# EAGLE design SmartCoffee (EAGLE 7.6.0)
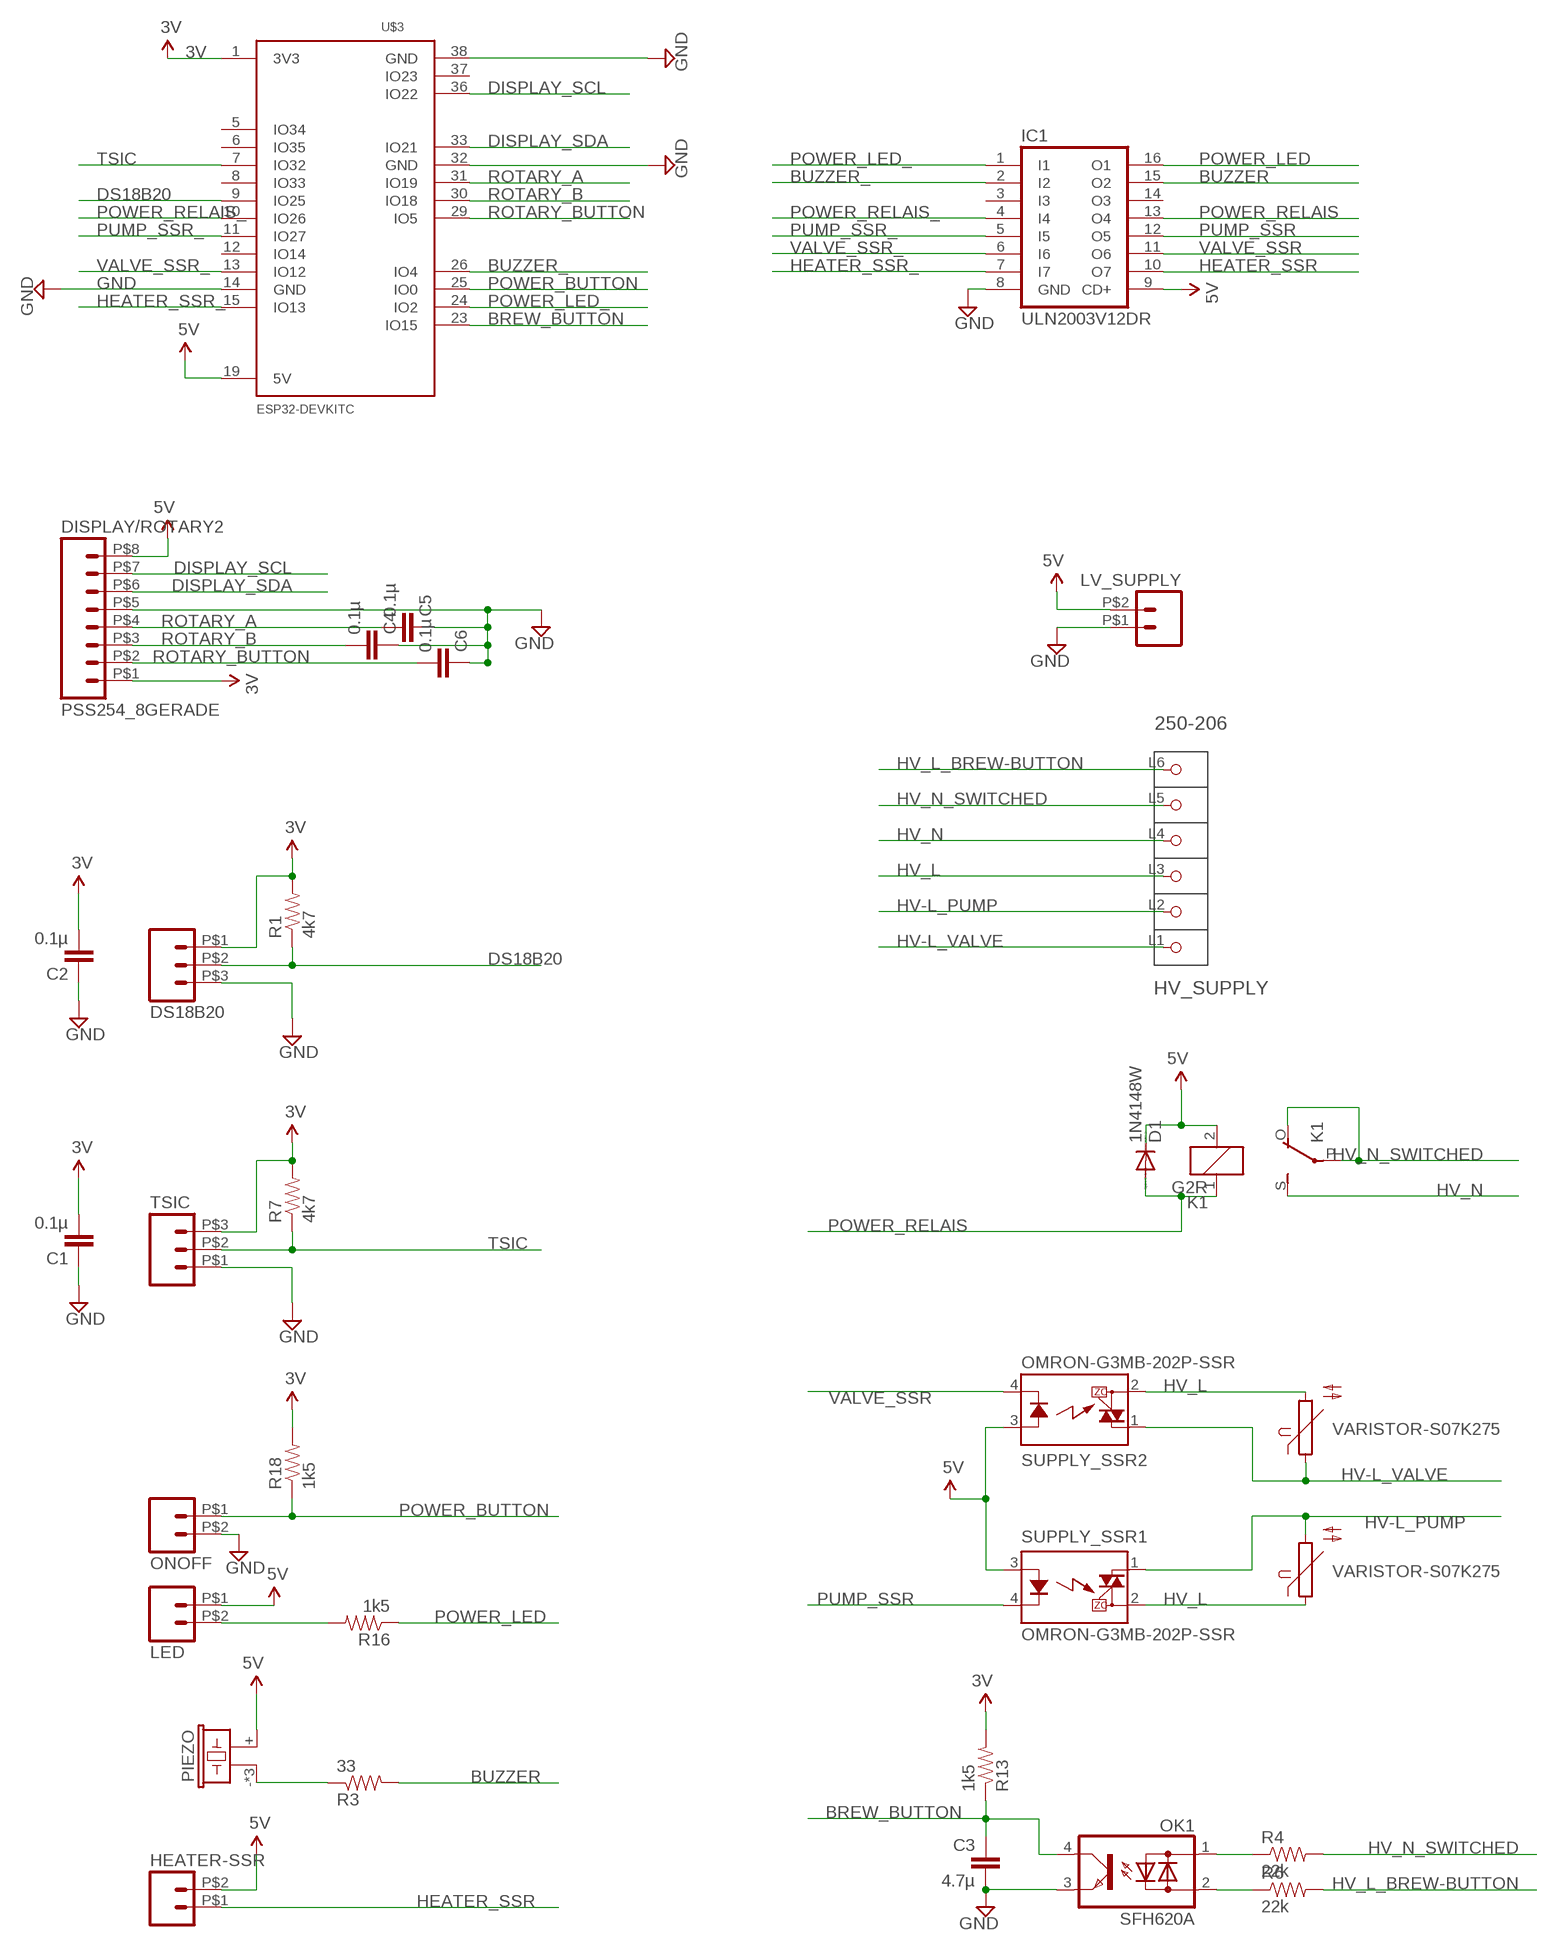
[diagram p0: schematic, sheet 1]

## Parts
C1  0.1µ  CAP0603-CAP  [0603-CAP]
C2  0.1µ  CAP0603-CAP  [0603-CAP]
C3  4.7µ  CAP0805-CAP  [0805-CAP]
C4  0.1µ  CAP0603-CAP  [0603-CAP]
C5  0.1µ  CAP0603-CAP  [0603-CAP]
C6  0.1µ  CAP0603-CAP  [0603-CAP]
D1  1N4148W  DIODE-SOD123  [SOD123]
DISPLAY/ROTARY2  PSS254_8GERADE  [08G]
DS18B20  PSS254_3GERADE  [03G]
HEATER-SSR  PSS254_2GERADE  [02G]
HV_SUPPLY  250-206  [P-250-206]
IC1  ULN2003V12DR  ULN2003AD  [SO16]
K1  G2R  [G2R]
LED  PSS254_2GERADE  [02G]
LV_SUPPLY  PSS254_2GERADE  [02G]
OK1  SFH620A  [DIL04]
ONOFF  PSS254_2GERADE  [02G]
PIEZO  BUZZER-PIEZO_SMD  [BUZZER-PIEZO_SMD]
R1  4k7  RESISTOR0603-RES  [0603-RES]
R3  33  RESISTOR0603-RES  [0603-RES]
R4  22k  RESISTORUPRIGHT  [RES_UPRIGHT]
R5  VARISTOR-S07K275  [S07K275]
R6  22k  RESISTORUPRIGHT  [RES_UPRIGHT]
R7  4k7  RESISTOR0603-RES  [0603-RES]
R8  VARISTOR-S07K275  [S07K275]
R13  1k5  RESISTOR0603-RES  [0603-RES]
R16  1k5  RESISTOR0603-RES  [0603-RES]
R18  1k5  RESISTOR0603-RES  [0603-RES]
SUPPLY_SSR1  OMRON-G3MB-202P-SSR  [OMRON-G3MB-202P-SSR]
SUPPLY_SSR2  OMRON-G3MB-202P-SSR  [OMRON-G3MB-202P-SSR]
TSIC  PSS254_3GERADE  [03G]
U$3  ESP32DEVKITC  [ESP32-DEVKITC]

## Nets
3V [power]: C1.2 C2.2 DISPLAY/ROTARY2.P$1 DS18B20.P$1 R1.2 R7.2 R13.2 R18.2 TSIC.P$3 U$3.1(3V3)
BREW_BUTTON: C3.1 OK1.4(C) R13.1 U$3.23(IO15)
BUZZER: IC1.15(O2) R3.2
BUZZER_: IC1.2(I2) U$3.26(IO4)
DISPLAY_SCL: DISPLAY/ROTARY2.P$7 U$3.36(IO22)
DISPLAY_SDA: DISPLAY/ROTARY2.P$6 U$3.33(IO21)
DS18B20: DS18B20.P$2 R1.1 U$3.9(IO25)
GND: C1.1 C2.1 C3.2 C4.1 C5.1 C6.1 DISPLAY/ROTARY2.P$5 DS18B20.P$3 IC1.8(GND) LV_SUPPLY.P$1 OK1.3(E) ONOFF.P$2 TSIC.P$1 U$3.14(GND) U$3.32(GND) U$3.38(GND)
HEATER_SSR: HEATER-SSR.P$1 IC1.10(O7)
HEATER_SSR_: IC1.7(I7) U$3.15(IO13)
HV-L_PUMP [HV]: HV_SUPPLY.L2(P2) R8.2 SUPPLY_SSR1.1(DS1)
HV-L_VALVE [HV]: HV_SUPPLY.L1(P1) R5.1 SUPPLY_SSR2.1(DS1)
HV_L [HV]: HV_SUPPLY.L3(P3) R5.2 R8.1 SUPPLY_SSR1.2(DS2) SUPPLY_SSR2.2(DS2)
HV_L_BREW-BUTTON [power]: HV_SUPPLY.L6(P6) R6.2
HV_N [HV]: HV_SUPPLY.L4(P4) K1.S(2:S)
HV_N_SWITCHED [HV]: HV_SUPPLY.L5(P5) K1.O(2:O) K1.P(2:P) R4.2
N$1: LED.P$2 R16.2
N$2: OK1.1(AC1) R4.1
N$3: PIEZO.- PIEZO.DUMMY PIEZO.DUMMY1 R3.1
N$4: OK1.2(AC2) R6.1
POWER_BUTTON: ONOFF.P$1 R18.1 U$3.25(IO0)
POWER_LED: IC1.16(O1) R16.1
POWER_LED_: IC1.1(I1) U$3.24(IO2)
POWER_RELAIS: D1.A IC1.13(O4) K1.1
POWER_RELAIS_: IC1.4(I4) U$3.10(IO26)
PUMP_SSR: IC1.12(O5) SUPPLY_SSR1.4(K)
PUMP_SSR_: IC1.5(I5) U$3.11(IO27)
ROTARY_A: C5.2 DISPLAY/ROTARY2.P$4 U$3.31(IO19)
ROTARY_B: C4.2 DISPLAY/ROTARY2.P$3 U$3.30(IO18)
ROTARY_BUTTON: C6.2 DISPLAY/ROTARY2.P$2 U$3.29(IO5)
TSIC: R7.1 TSIC.P$2 U$3.7(IO32)
VALVE_SSR: IC1.11(O6) SUPPLY_SSR2.4(K)
VALVE_SSR_: IC1.6(I6) U$3.13(IO12)
VCC [power]: D1.C DISPLAY/ROTARY2.P$8 HEATER-SSR.P$2 IC1.9(CD+) K1.2 LED.P$1 LV_SUPPLY.P$2 PIEZO.+ SUPPLY_SSR1.3(A) SUPPLY_SSR2.3(A) U$3.19(5V) ; supply symbol labelled 5V
Unconnected: IC1.3(I3) IC1.14(O3) U$3.5(IO34) U$3.6(IO35) U$3.8(IO33) U$3.12(IO14) U$3.37(IO23)

## Library data of the parts
C1 C2 C4-C6 = LowPowerLab:CAP: Capacitor Standard 0603 ceramic capacitor, and 0.1" leaded capacitor.; BUERKLIN: 53 D 1726
C3 = myLib:CAP: Capacitor Standard 0603 ceramic capacitor, and 0.1" leaded capacitor.; BUERKLIN: 53 D 1659
D1 = diode:DIODE-: DIODE; BUERKLIN: 26S8142
DISPLAY/ROTARY2 = con-pss254_reichelt:PSS254_8; REICHELT: PSS 254/8G
DS18B20 TSIC = con-pss254_reichelt:PSS254_3; REICHELT: PSS 254/3G
HEATER-SSR LED LV_SUPPLY ONOFF = con-pss254_reichelt:PSS254_2; REICHELT: PSS 254/2G
HV_SUPPLY = con-wago_250:250-206: Serie 250, 1-Leiter-Klemmenleiste für Leiterplatten 1 Lötstift/Pol versetzt / Series 250, 1-conductor PCB terminal strip 1 solder pin/pole, staggered Polzahl / Pole No.: 6 Rastermaß / Pitch: 3.5 - 3.5 mm Bemessungsspannung / Rated Voltage: 320 V Nennstrom / Nominal Current: 8 A Leiterquerschnitt / Conductor Size: 0.2 - 1.5 mm2 Anschlusstechnik / Connection Technology: CAGE CLAMP® S Lötstiftlänge: / Solder Pin Length: 3.6 mm Leitereinführung (zur Platine) / Conductor entry angle (to PCB): 45 ° Farbe / Color: grau / gray Stand: 01.01.2014. Die jeweils aktuellen Daten zu diesem Artikel finden Sie in unserem Produktkatalog, den Sie unter www.wago.com einsehen können. As of: 01/01/2014. Please find the newest data for this article in our product catalogue, which can be viewed under www.wago.com.
IC1 = uln-udn:ULN2003A: DRIVER ARRAY; CONRAD: 1187534 - 62
K1 = Omron-G2RL:G2R: RELAY 1 x switch, Omron
OK1 = optocoupler:SFH620: Optocoupler, Phototransistor Output, AC Input Source: http://www.vishay.com/docs/83675/sfh620.pdf; MPN: SFH620A-2; OC_FARNELL: 1469594; OC_NEWARK: 97K9546
PIEZO = myLib:BUZZER-PIEZO_SMD: Piezoelectric Acoustic Transducer; BERKLIN_2: 36 M 346; BUERKLIN: 36 M 370; BUERKLIN_1: 36 M 368
R1 R7 = LowPowerLab:RESISTOR: Resistor Basic schematic elements and footprints for 0603, 1206, and PTH resistors.; BUERKLIN: 26 E 808
R3 = LowPowerLab:RESISTOR: Resistor Basic schematic elements and footprints for 0603, 1206, and PTH resistors.; BUERKLIN: 26 E 756
R4 R6 = myLib:RESISTOR: Resistor Basic schematic elements and footprints for 0603, 1206, and PTH resistors.
R5 R8 = myLib:VARISTOR-S07K275: VARISTOR; BUERKLIN: 82E2252
R13 R16 R18 = LowPowerLab:RESISTOR: Resistor Basic schematic elements and footprints for 0603, 1206, and PTH resistors.; BUERKLIN: 26 E 796
SUPPLY_SSR1 SUPPLY_SSR2 = myLib:OMRON-G3MB-202P-SSR: IT(rms) 8A, Zero Cross type SIP 4pin Triac output SSR Source: http://sharp-world.com/products/device/lineup/data/pdf/datasheet/s102s02_e.pdf
U$3 = ESP32-DEVKITC:ESP32DEVKITC

## Net classes
0 default: width 0.381 mm, clearance 0.254 mm
1 power: width 0.508 mm, clearance 0.508 mm
2 HV: width 3.048 mm, drill 0.127 mm, clearance 1.143 mm

## Board
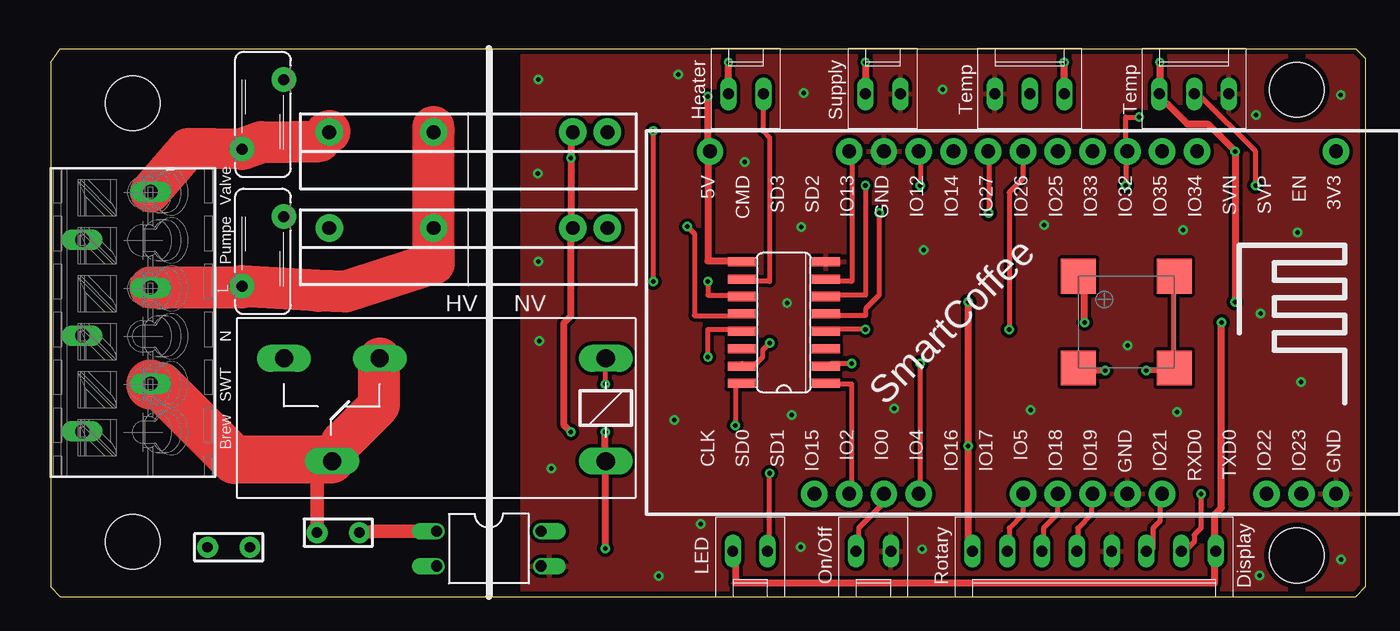
[diagram p1: board, top side]
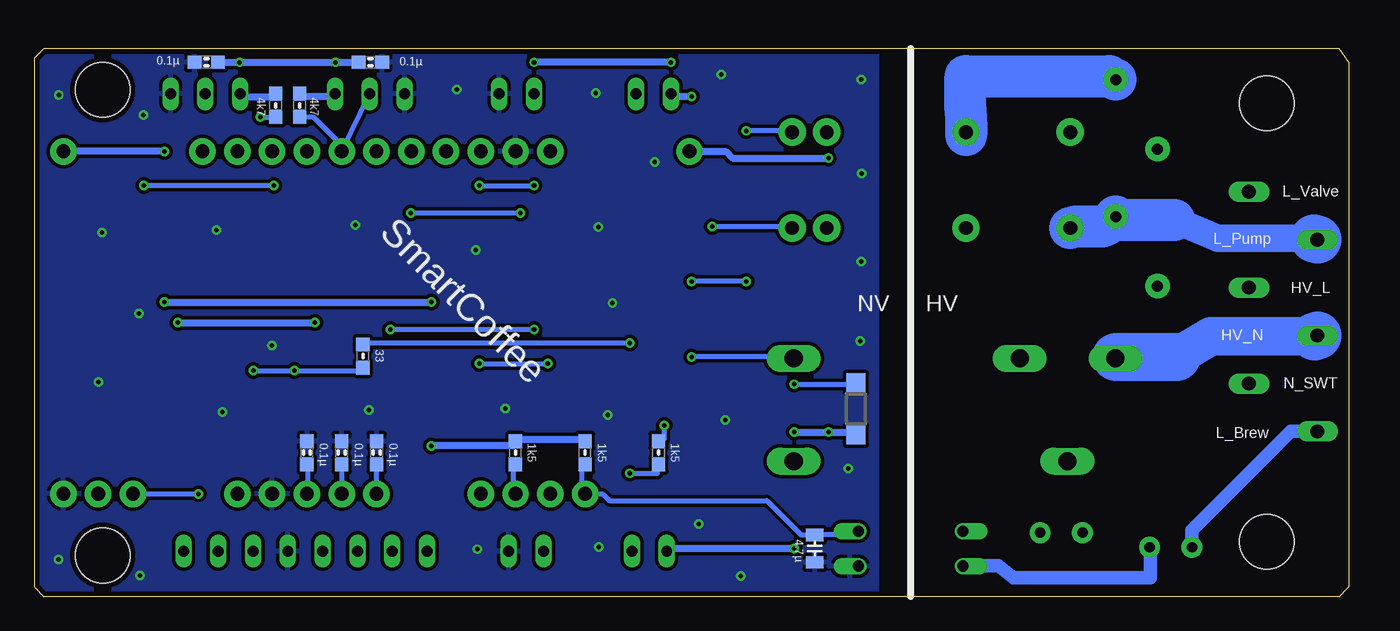
[diagram p2: board, bottom side, seen from below]

Size 96 x 40 mm. Coordinates in mm from the lower left corner, seen from the top.
Outline: 0.7,0 95.3,0 96,0.7 96,39.3 95.3,40 0.7,40 0,39 0,0.7 0.7,0
Copper layers (1*16): Top 0.0356mm / dielectric 1.5011mm / Bottom 0.0356mm
Design rules "oshpark-2layer *": minimum track width 6mil, minimum drill 13mil, track to track 6mil, track to pad 6mil, pad to pad 6mil, via to via 6mil, smd to smd 6mil, copper to edge 15mil, drill to drill 6mil, minimum pad ring 7mil, minimum via ring 7mil, stop-mask expansion 2.5mil, vias tented up to drill 100mil, thermal gap 10mil
Holes 4 mm at 6,4 6,36 91,37 91,3
bRestrict: area 26.5,17.9 to 27.1,18.5

### Footprints (pad centres in the part's own frame; a part is rotated, then mirrored left to right if it is on the bottom)
0603-CAP = smd 1.016 x 0.965: 1 -0.85,0; 2 0.85,0
0805-CAP = smd 0.902 x 1.3: 1 -1,0; 2 1,0
SOD123 = smd 1.4 x 1.4: A 1.9,0; C -1.9,0
08G = drill 0.8 long: P$1 1.27,3.31; P$2 3.81,3.31; P$3 6.35,3.31; P$4 8.89,3.31; P$5 11.43,3.31; P$6 13.97,3.31; P$7 16.51,3.31; P$8 19.05,3.31
03G = drill 0.8 long: P$1 1.27,3.31; P$2 3.81,3.31; P$3 6.35,3.31
02G = drill 0.8 long: P$1 1.27,3.31; P$2 3.81,3.31
P-250-206 = drill 1 long: L1 1.3,9.55; L2 -3.7,6.05; L3 1.3,2.55; L4 -3.7,-0.95; L5 1.3,-4.45; L6 -3.7,-7.95
SO16 = smd 0.66 x 2.032: 1 -4.445,-3.073; 2 -3.175,-3.073; 3 -1.905,-3.073; 4 -0.635,-3.073; 5 0.635,-3.073; 6 1.905,-3.073; 7 3.175,-3.073; 8 4.445,-3.073; 9 4.445,3.073; 10 3.175,3.073; 11 1.905,3.073; 12 0.635,3.073; 13 -0.635,3.073; 14 -1.905,3.073; 15 -3.175,3.073; 16 -4.445,3.073
G2R = drill 1.321 long: 1 -2.54,-3.683; 2 -2.54,3.81; O 13.97,-3.683; P 17.45,3.81; S 20.955,-3.683
DIL04 = drill 0.813 offset: 1 -1.27,-3.81; 2 1.27,-3.81; 3 1.27,3.81; 4 -1.27,3.81
BUZZER-PIEZO_SMD = smd 2.54 x 2.54: + 0,6.7; - 7,6.7; DUMMY 0,0; DUMMY1 7,0
0603-RES = smd 1.016 x 0.965: 1 -0.85,0; 2 0.85,0
RES_UPRIGHT = drill 0.762 pad 1.524: 1 -1.548,0; 2 1.548,0
S07K275 = drill 0.8 pad 1.8: 1 -1.524,-2.54; 2 1.524,2.54
OMRON-G3MB-202P-SSR = drill 1 pad 2: 1 -10.16,1.4; 2 -2.54,1.4; 3 7.62,1.4; 4 10.16,1.4
ESP32-DEVKITC = drill 1 pad 1.93: 1 -22.87,-12.5; 5 -12.71,-12.5; 6 -10.17,-12.5; 7 -7.63,-12.5; 8 -5.09,-12.5; 9 -2.55,-12.5; 10 -0.01,-12.5; 11 2.53,-12.5; 12 5.07,-12.5; 13 7.61,-12.5; 14 10.15,-12.5; 15 12.69,-12.5; 19 22.85,-12.5; 23 15.23,12.5; 24 12.69,12.5; 25 10.15,12.5; 26 7.61,12.5; 29 -0.01,12.5; 30 -2.55,12.5; 31 -5.09,12.5; 32 -7.63,12.5; 33 -10.17,12.5; 36 -17.79,12.5; 37 -20.33,12.5; 38 -22.87,12.5

### Placement (x,y rotation side)
C1  83.44,39 0 bottom
C2  71.46,39 180 bottom
C3  39,3.5 270 bottom
C4  73.56,10.5 270 bottom
C5  76.09,10.5 270 bottom
C6  71,10.5 270 bottom
D1  36,13.7 90 bottom
DISPLAY/ROTARY2  66.05,0 0 top
DS18B20  75.31,40 180 top
HEATER-SSR  53.31,40 180 top
HV_SUPPLY  6,20 0 top
IC1  53.54,20 90 top
K1  38,13.7 180 top
LED  48.54,0 0 top
LV_SUPPLY  63.31,40 180 top
OK1  32,3.5 270 top
ONOFF  57.54,0 0 top
PIEZO  75.06,16.69 0 top
R1  76.61,35.86 90 bottom
R3  71.99,17.55 90 bottom
R4  21,4.67 180 top
R5  15.5,35.2 0 top
R6  13,3.6 180 top
R7  78.36,35.86 90 bottom
R8  15.5,25.2 0 top
R13  55.78,10.5 90 bottom
R16  50.41,10.5 270 bottom
R18  60.86,10.5 90 bottom
SUPPLY_SSR1  30.5,25.5 0 top
SUPPLY_SSR2  30.5,32.5 0 top
TSIC  87.31,40 180 top
U$3  71,20 180 top

### Tracks (layer width: path | path; a pad name or v marks a point on that pad's centre or on a via)
3V  (via drill 0.33)
  Top 0.508: DISPLAY/ROTARY2.P$1 67,3.5 v67,11 v67,21.5 | v74,39 74,37 DS18B20.P$1 | v81,39 81,37 TSIC.P$3 81,36.5 81,36 81.5,36 83,34.5 84.5,34.5 v86.5,32.5 v86.5,21.5
  Bottom 0.508: R13.2 56,11.5 60.5,11.5 R18.2 61,11 v67,11 | R7.2 78.5,36.5 80.5,36.5 TSIC.P$3 | R1.2 76.5,36.5 74.5,36.5 DS18B20.P$1 | C1.2 v81,39 v74,39 C2.2 | v86.5,32.5 U$3.1 | v86.5,21.5 v67,21.5
BREW_BUTTON
  Bottom 0.381: OK1.4 36,4.5 C3.1 40,4.5 42.5,7 54,7 54.5,7.5 U$3.23 56,7.5 56,9.5 R13.1
BUZZER  (via drill 0.33)
  Top 0.381: v52.5,18.5 52,18 52,17.5 51.5,17 50.5,17 IC1.15
  Bottom 0.381: v52.5,18.5 72,18.5 R3.2
BUZZER_  (via drill 0.33)
  Top 0.381: v58.5,17 57,17 IC1.2 | v63.5,17 63.5,7.5 U$3.26
  Bottom 0.381: v63.5,17 v58.5,17
DISPLAY_SCL  (via drill 0.33)
  Top 0.381: v84,7.5 84,5 83.5,4.5 83.5,4 83,3.5 DISPLAY/ROTARY2.P$7
  Bottom 0.381: U$3.36 v84,7.5
DISPLAY_SDA
  Top 0.381: DISPLAY/ROTARY2.P$6 80.5,3.5 80.5,5 81,5.5 81,7.5 U$3.33
DS18B20
  Bottom 0.381: DS18B20.P$2 U$3.9 73.55,32.94 75.59,34.98 76.57,34.98 R1.1
GND  (via drill 0.33)
  other vias: 63.75,25.3 54.81,26.97 53.77,21.44 45.54,12.88 61.59,13.72 71.58,13.61 91.31,15.67 91.06,26.57 94.23,2.69 63.65,3.45 54.76,3.61 44.4,1.5 36.55,9.35 35.69,18.67 35.61,24.46 35.59,30.89 35.61,37.74 54.99,36.75 65.15,37.01 54.1,13.26 78.64,18.34 82.25,13.46 82.7,26.77 72.54,27.13 50.67,31.72 88.34,20.68 94.21,36.63 88.29,1.55 88.01,35.15 45.82,38.1 47.47,5.31
  pour Bottom: 104.01,-3.33 104.01,44.02 34.5,43.87 34.5,-3.4
  pour Top: 102.82,40.84 102.44,-1.93 34.5,-3.1 34.5,40.56
HEATER_SSR
  Top 0.381: IC1.10 50.5,23 52.5,23 52.5,33.5 52,34 52,36.5 HEATER-SSR.P$1
HEATER_SSR_
  Top 0.381: IC1.7 57,23 58.5,23 58.5,32.5 U$3.15
HV-L_PUMP
  Bottom 2: 2.55,26.15 9.55,26.15 12.78,27.5
  Bottom 3.048: 17,27.5 12.78,27.5 | 17,27.5 R8.2 | SUPPLY_SSR1.1 20,27 18,27 17,27.5
  Bottom 3.5: 2.55,26.15 HV_SUPPLY.L2
HV-L_VALVE
  Top 3: R5.1 10.03,32.71 HV_SUPPLY.L1
  Top 3.048: SUPPLY_SSR2.1 20.37,33.98 20.24,33.96 19.61,33.26 15.4,33.18 R5.1
HV_L
  Top 3.048: HV_SUPPLY.L3 13.97,22.54 R8.1 19.56,22.31 21.54,22.26 28,24.33 SUPPLY_SSR1.2 27.94,26.99 27.94,34 | 27.94,34.29 27.94,34 | SUPPLY_SSR2.2 28,34 27.94,34
  Bottom 3.048: 27.94,34.29 SUPPLY_SSR2.2 | R5.2 17.5,38 28,38 28,35.5 27.94,34.29 | 27.94,34.29 27.94,33.68
HV_L_BREW-BUTTON
  Bottom 1: HV_SUPPLY.L6 4.23,12.05 11.45,4.83 R6.2
HV_N
  Bottom 2.8: 2.5,19 10.08,19 12.6,17.5
  Bottom 3.048: 17,17.5 K1.S
  Bottom 3.5: 17,17.5 12.6,17.5 | 2.5,19 HV_SUPPLY.L4
HV_N_SWITCHED
  Top 1: K1.P 19.45,9.89 R4.2
  Top 3.048: 8.01,15.37 7.3,15.4 | K1.P 20.48,10 21.27,11.27 23.97,13.97 23.97,17.3 K1.O
  Top 3.5: 8.01,15.37 13.4,9.98 20.48,10 | 7.3,15.4 HV_SUPPLY.L5
N$1  (via drill 0.33)
  Top 0.381: v52.5,9 52.5,3.5 LED.P$2
  Bottom 0.381: v52.5,9 50.5,9 50.5,9.5 R16.2
N$2
  Top 1: R4.1 23.69,4.77 OK1.1
N$3  (via drill 0.33)
  Top 0.381: v77,16.5 75.5,16.5 PIEZO.DUMMY | PIEZO.- 82,23 82,17 PIEZO.DUMMY1 82,16.5 v80,16.5
  Bottom 0.381: R3.1 72,16.5 v77,16.5 v80,16.5
N$4
  Bottom 0.381: 27.95,2.25 OK1.2 | 14.5,3.5 R6.1
  Bottom 1: 27.95,2.25 25.6,2.25 24.5,1.36 14.5,1.36 14.5,3.5
POWER_BUTTON
  Top 0.381: ONOFF.P$1 59,3.5 59,5 61,7 61,7.5 U$3.25
  Bottom 0.381: R18.1 61,9.5 61,7.5 U$3.25
POWER_LED  (via drill 0.33)
  Top 0.381: v50,12.5 50,15.5 IC1.16
  Bottom 0.381: v50,12.5 50,11.5 R16.1
POWER_LED_
  Top 0.381: IC1.1 57,15.5 58.5,15.5 58.5,7.5 U$3.24
POWER_RELAIS  (via drill 0.33)
  Top 0.381: v40.5,15.5 40.5,17 K1.1 | v48,17.5 48,19.5 50,19.5 IC1.13
  Bottom 0.381: v40.5,15.5 36,15.5 D1.A | v48,17.5 41,17.5 K1.1
POWER_RELAIS_  (via drill 0.33)
  Top 0.381: v59.5,19.5 57,19.5 IC1.4 | v70,19.5 70,29.5 71,30.5 U$3.10
  Bottom 0.381: v70,19.5 v59.5,19.5
PUMP_SSR  (via drill 0.33)
  Top 0.381: v46.5,27 47,26.5 47,20.5 50,20.5 IC1.12
  Bottom 0.381: v46.5,27 41,27 SUPPLY_SSR1.4
PUMP_SSR_  (via drill 0.33)
  Top 0.381: v60.5,28 60.5,22 59.5,21 59.5,20.5 57,20.5 IC1.5 | v68.5,28 68.5,32.5 U$3.11
  Bottom 0.381: v68.5,28 v60.5,28
ROTARY_A
  Top 0.381: DISPLAY/ROTARY2.P$4 75,3.5 75,5 76,6 76,7.5 U$3.31
  Bottom 0.381: C5.2 76,9.5 76,7.5 U$3.31
ROTARY_B
  Top 0.381: DISPLAY/ROTARY2.P$3 72.5,3.5 72.5,5 73.5,6 73.5,7.5 U$3.30
  Bottom 0.381: C4.2 73.5,9.5 73.5,7.5 U$3.30
ROTARY_BUTTON
  Top 0.381: DISPLAY/ROTARY2.P$2 70,3.5 70,5 71,6 U$3.29
  Bottom 0.381: C6.2 71,9.5 U$3.29
TSIC  (via drill 0.33)
  Top 0.381: v79.5,35 78.5,35 78.5,32.5 | v88,30 88,32.5 84,36.5 TSIC.P$2 | 78.5,32.5 v78.5,30 | 78.5,32.5 U$3.7
  Bottom 0.381: v79.5,35 78.5,35 R7.1 | v78.5,30 v88,30
VALVE_SSR  (via drill 0.33)
  Top 0.381: v48,23 48,22 50,22 IC1.11 | v44,34 v44,23
  Bottom 0.381: v44,23 v48,23 | v44,34 41,34 SUPPLY_SSR2.4
VALVE_SSR_  (via drill 0.33)
  Top 0.381: v59.5,30 59.5,22 57,22 IC1.6 | v63.5,30 63.5,32.5 U$3.13
  Bottom 0.381: v63.5,30 v59.5,30
VCC  (via drill 0.33)
  Top 0.508: SUPPLY_SSR2.3 38,33.5 v38,32 38,27 SUPPLY_SSR1.3 38,26.5 38,20.5 37.5,20 37.5,12.5 v38,12 | 48,32.5 48,24.5 50,24.5 IC1.9 | 48,32.5 v48,36.5 | 48,32.5 U$3.19 | v59.5,39 59.5,37 LV_SUPPLY.P$2 | v49.5,39 49.5,37 HEATER-SSR.P$2 | v40.5,12 40.5,10 K1.2 40.5,9.5 v40.5,3.5 | LED.P$1 50,3 50,1 85,1 85,3 DISPLAY/ROTARY2.P$8 85,3.5 85,6 85.5,6.5 v85.5,20 | v75.5,20 75.5,23 PIEZO.+
  Bottom 0.508: v48,36.5 49.5,36.5 HEATER-SSR.P$2 | v49.5,39 v59.5,39 | v38,32 45,32 45.5,32.5 U$3.19 | v40.5,12 v38,12 36,12 D1.C | v40.5,3.5 49.5,3.5 LED.P$1 | v85.5,20 v75.5,20

### Text on the board
_tsilk: Heater | Supply | Temp | Temp | Valve | Pumpe | L | HV | NV | SmartCoffee | N | SWT | Brew | LED | On/Off | Rotary | Display
_bsilk: L_Valve | L_Pump | HV_L | SmartCoffee | HV | NV | HV_N | N_SWT | L_Brew